# Altium project CZ100_V1.0.PrjPCB
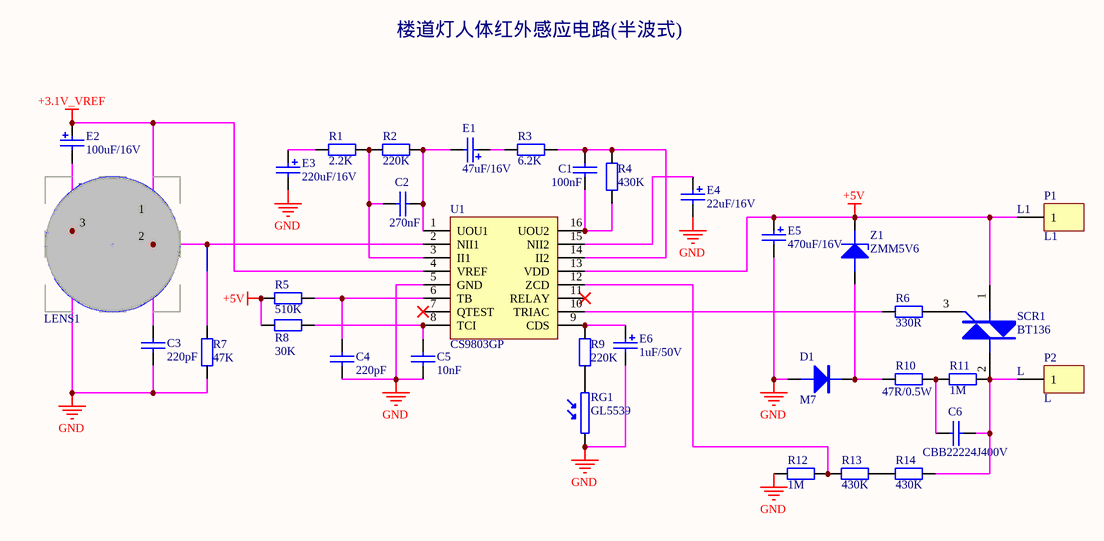
[diagram p0: CZ100_V1.0.SchDoc]
1 sheet, 35 parts. Net scope: global (net labels, ports and power ports of the same name join across sheets).
Board files: CZ100_V1.0.PcbDoc, CZ100_Weld_V1.0.PcbDoc

## Sheet CZ100_V1.0.SchDoc
size A4

### Parts
C1  100nF  [0805_C1]
C2  270nF  [0805_C1]
C3  220pF  [0805_C1]
C4  220pF  [0805_C1]
C5  10nF  [0805_C1]
C6  CBB22224J400V  [CBB22224J400V]
D1  M7  [DO-214AC(SMA)]
E1  47uF/16V  [CS_47uF/25V]
E2  100uF/16V  [CS_100uF/16V]
E3  220uF/16V  [CS_220uF/16V]
E4  22uF/16V  [CS_47uF/25V]
E5  470uF/16V  [CS_470uF/16V]
E6  1uF/50V  [CS_47uF/25V]
LENS1  Fresnel lens  [Fresnel lens]  (value not drawn)
P1  L1  [CP3M*8.8]
P2  L  [CP3M*8.8]
PRI1  KP500BP  [D203S]
R1  2.2K  [0805_R]
R2  220K  [0805_R]
R3  6.2K  [0805_R]
R4  430K  [0805_R]
R5  510K  [0805_R]
R6  330R  [1206_R]
R7  47K  [0805_R]
R8  30K  [0805_R]
R9  220K  [0805_R]
R10  47R/0.5W  [RT50]
R11  1M  [1206_R]
R12  1M  [0805_R]
R13  430K  [1206_R]
R14  430K  [1206_R]
RG1  GL5539  [R5537]
SCR1  BT136  [TO-252]
U1  CS9803GP  [DIP-16]
Z1  ZMM5V6  [LL-34]

### Nets
+3.1V_VREF: E2.1 PRI1.1(D) U1.4(VREF)
+5V: E5.1 P1.1 R5.2 R8.2 SCR1.1(T) U1.13(VDD) Z1.K
GND: C3.2 C4.2 C5.2 D1.A E2.2 E3.2 E4.2 E5.2 E6.2 PRI1.3(G) R7.1 R12.2 RG1.1 U1.5(GND)
NetC1_1: C1.1 R4.2 U1.16(UOU2)
NetC1_2: C1.2 R3.1 R4.1 U1.14(II2)
NetC2_1: C2.1 E1.2 R2.2 U1.1(UOU1)
NetC2_2: C2.2 R1.2 R2.1 U1.3(II1)
NetC3_1: C3.1 PRI1.2(S) R7.2 U1.2(NII1)
NetC4_1: C4.1 R5.1 U1.6(TB)
NetC5_1: C5.1 R8.1 U1.8(TCI)
NetC6_1: C6.1 P2.1 R11.1 R14.2 SCR1.2(T)
NetC6_2: C6.2 R10.2 R11.2
NetD1_K: D1.K R10.1 Z1.A
NetE1_1: E1.1 R3.2
NetE3_1: E3.1 R1.1
NetE4_1: E4.1 U1.15(NII2)
NetE6_1: E6.1 R9.2 U1.9(CDS)
NetR6_1: R6.1 U1.10(TRIAC)
NetR6_2: R6.2 SCR1.3(G)
NetR9_1: R9.1 RG1.2
NetR12_1: R12.1 R13.2 U1.12(ZCD)
NetR13_1: R13.1 R14.1

Not connected (* = marked no-connect by the designer): U1 7(QTEST)* 11(RELAY)*

### Notes on the sheet
- 楼道灯人体红外感应电路(半波式)
- (near P1) L1
- L

### Library data of the parts
C1-C6 = Cap1
D1 = Diode-A: SS14,SS24,SS34,M7
E1-E6 = Cap Pol1: CS_100uF/16V: D=5mm , PIN Spacing= 2mm; CS_1000uF/16V: D=10mm , PIN Spacing= 3.5mm; CS_470uF/16V: D=8mm , PIN Spacing= 3.5mm; CS_100uF/25V: D=6.3mm , PIN Spacing= 2.5mm; CS_470uF/25V: D=10mm , PIN Spacing= 3.5mm; CS_1000uF/25V: D=10mm , PIN Spacing= 3.5mm; CS_220uF/25V: D=8mm , PIN Spacing= 3.5mm; CS_220uF/16V: D=6.3mm , PIN Spacing= 2.5mm; CS_47uF/25V: D=5mm , PIN Spacing= 2mm
P1 P2 = Header 1: Header, 1-Pin; LatestRevisionDate: 17-Jul-2002; LatestRevisionNote: Re-released for DXP Platform.; Publisher: Altium Limited
PRI1 = D203S: D203S, KP500BP
R1-R14 = Res1: Name: Resistor; Power: 0210(1/20W 25V), 0402(1/16W  50V),0603(1/16W  50V),0805(1/10W  150V),1206(1/8W  200V),1210(1/4W  200V),1812(1/2W  200V),2010(1/2W  200V),2512(1W  200V),
SCR1 = TRIAC
Z1 = Diode-B